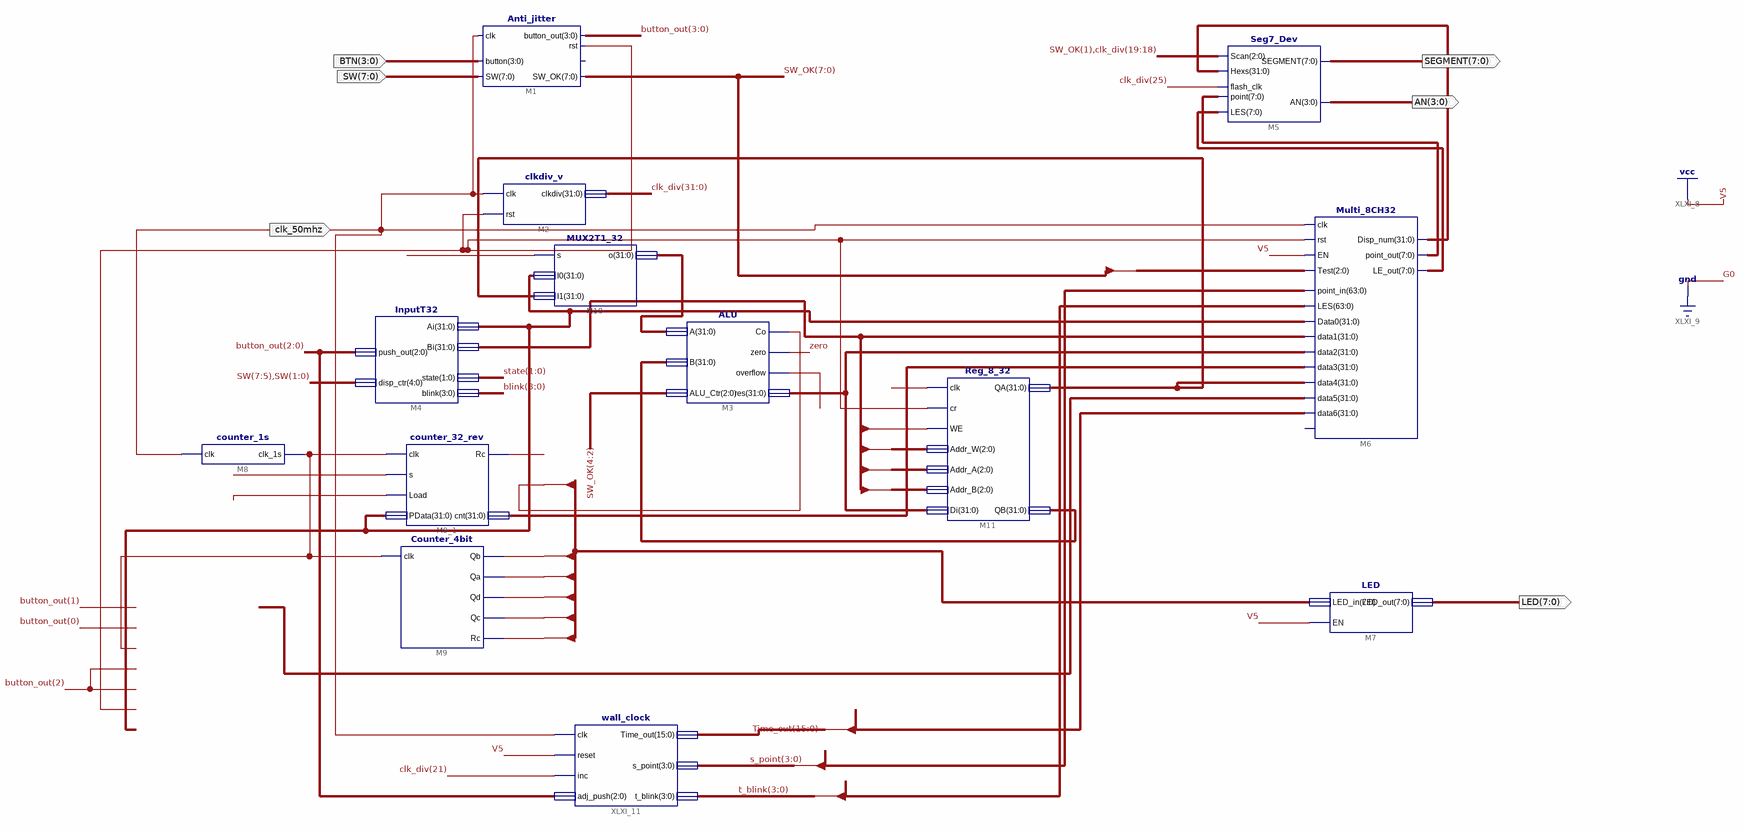
[diagram p0: schematic sheet 1]
// Xilinx ISE schematic Calculation.sch (spartan3) as structural Verilog: 13 symbols, 6 ports
module Calculation (
  input  clk_50mhz,
  input  [3:0] BTN,
  input  [7:0] SW,
  output [7:0] SEGMENT,
  output [3:0] AN,
  output [7:0] LED
);

  wire Co, N0, Qa, Qb, Qc, Qd, Rc_4, Rc_32, XLXN_21, XLXN_74, XLXN_76, zero;
  wire [1:0] state;
  wire [3:0] blink, button_out, s_point, t_blink;
  wire [7:0] SW_OK, XLXN_30, XLXN_31;
  wire [15:0] Time_out;
  wire [31:0] Bi, clk_div, XLXN_12, XLXN_27, XLXN_55, XLXN_65, XLXN_66, XLXN_70, XLXN_79, XLXN_80;

  Anti_jitter M1 (
    .clk(clk_50mhz), .SW(SW), .button(BTN), .rst(XLXN_76), .button_out(button_out), .SW_OK(SW_OK));  // open: button_pulse
  clkdiv_v M2 (.clk(clk_50mhz), .rst(XLXN_76), .clkdiv(clk_div));
  ALU M3 (.A(XLXN_66), .B(XLXN_79), .ALU_Ctr(SW_OK[4:2]), .Co(Co), .zero(zero), .overflow(XLXN_21), .res(XLXN_70));
  InputT32 M4 (
    .blink(blink), .state(state), .disp_ctr({SW[7:5], SW[1:0]}), .Ai(XLXN_12), .push_out(button_out[2:0]),
    .Bi(Bi));
  Seg7_Dev M5 (
    .Hexs(XLXN_27), .LES(XLXN_30), .Scan({SW_OK[1], clk_div[19:18]}), .point(XLXN_31),
    .flash_clk(clk_div[25]), .SEGMENT(SEGMENT), .AN(AN));
  Multi_8CH32 M6 (
    .Test(SW_OK[7:5]), .point_in({{12{N0}}, s_point, {16{N0}}, clk_div}), .EN(1'b1), .clk(clk_50mhz),
    .rst(XLXN_76), .LES({{12{N0}}, t_blink, {32{N0}}, blink, blink, blink, blink}), .Data0(XLXN_12),
    .data1(Bi), .data2(XLXN_70), .data3(XLXN_55), .data4(XLXN_65), .data5(XLXN_80),
    .data6({{16{N0}}, Time_out}), .point_out(XLXN_31), .LE_out(XLXN_30), .Disp_num(XLXN_27));  // open: data7
  LED M7 (.LED_in({SW[1], Rc_4, Qd, Qc, Qb, Qa, N0, Co}), .EN(1'b1), .LED_out(LED));
  counter_1s M8 (.clk(clk_50mhz), .clk_1s(XLXN_74));
  counter_32_rev M9_1 (
    .clk(XLXN_74), .s(button_out[0]), .Load(button_out[1]), .PData(XLXN_12), .Rc(Rc_32), .cnt(XLXN_55));
  Counter_4bit M9 (.clk(XLXN_74), .Qb(Qb), .Qa(Qa), .Qd(Qd), .Qc(Qc), .Rc(Rc_4));
  Reg_8_32 M11 (
    .clk(button_out[3]), .cr(XLXN_76), .WE(Bi[12]), .Addr_W(Bi[2:0]), .Addr_A(Bi[6:4]), .Addr_B(Bi[10:8]),
    .Di(XLXN_70), .QA(XLXN_65), .QB(XLXN_79));
  MUX2T1_32 M10 (.s(Bi[13]), .I0(XLXN_12), .I1(XLXN_65), .o(XLXN_66));
  wall_clock XLXI_11 (
    .clk(clk_50mhz), .reset(1'b1), .inc(clk_div[21]), .adj_push(button_out[2:0]), .Time_out(Time_out),
    .s_point(s_point), .t_blink(t_blink));
endmodule
